# Altium schematic sheet Mesure.SchDoc
size A4
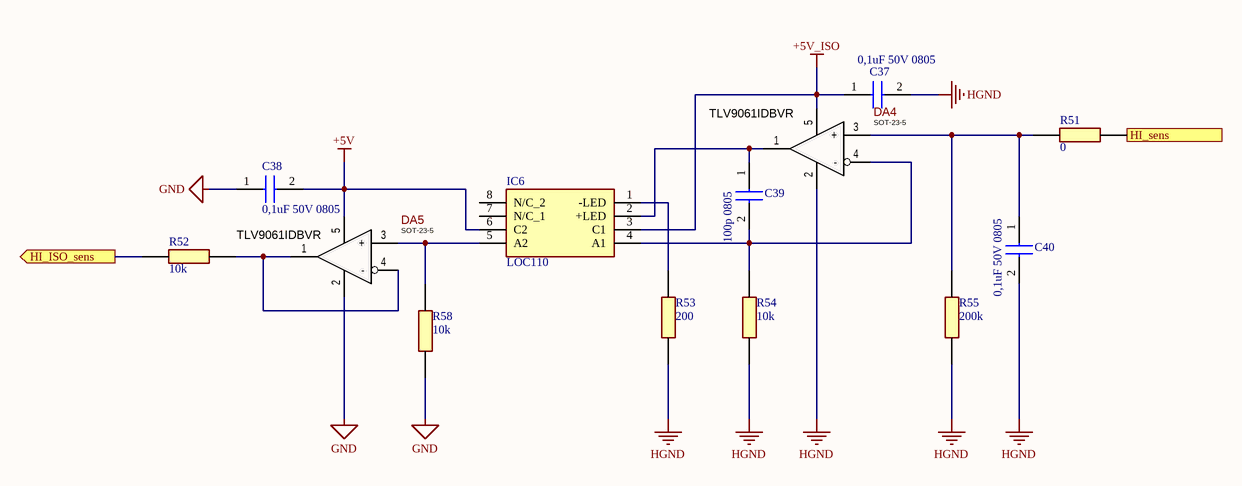
[diagram p0: Mesure.SchDoc]

## Parts
C37  0,1uF 50V 0805  [CAPC2012X90N]
C38  0,1uF 50V 0805  [CAPC2012X90N]
C39  100p 0805  [CAPC2012X90N]
C40  0,1uF 50V 0805  [CAPC2012X90N]
DA4  TLV9061IDBVR  [SOT-23-5]
DA5  TLV9061IDBVR  [SOT-23-5]
IC6  LOC110  [DIP762W53P254L965H335Q8N]
R51  0  [RESC2013X65N]
R52  10k  [RESC2013X65N]
R53  200  [RESC2013X65N]
R54  10k  [RESC2013X65N]
R55  200k  [RESC2013X65N]
R58  10k  [RESC2013X65N]

## Ports
HI_ISO_sens (out), HI_sens

## Nets
+5V: C38.2 DA5.5(V+) IC6.6(C2)
+5V_ISO: C37.1 DA4.5(V+) IC6.3(C1)
GND: C38.1 DA5.2(V-) R58.1
HGND: C37.2 C40.2 DA4.2(V-) R53.1 R54.1 R55.1
HI_ISO_sens: R52.2 ; port HI_ISO_sens
HI_sens: R51.1 ; port HI_sens
NetC39_1: C39.1 DA4.1(OUT) IC6.2(+LED)
NetC39_2: C39.2 DA4.4(-) IC6.4(A1) R54.2
NetC40_1: C40.1 DA4.3(+) R51.2 R55.2
NetDA5_1: DA5.1(OUT) DA5.4(-) R52.1
NetDA5_3: DA5.3(+) IC6.5(A2) R58.2
NetIC6_1: IC6.1(-LED) R53.2

Not connected (* = marked no-connect by the designer): IC6 7(N/C_1) 8(N/C_2)

## Library data of the parts
C37-C40 = MCMT21N470F250CT: Capacitor; Height: 0.9mm
DA4 DA5 = TLV9061IDBVR: 10MHz, 0.5pA Bias, Rail-to-Rail Input/Output, 1.8V CMOS Operational Amplifiers, 1 Channels, SOT-23-5; Manufacturer: Texas Instruments; Ajax_1C_ID: 24284; Ajax_1C_PN: TLV9061IDBVR TI 1.8V-5.5V Operational Amplifier IC SOT23-5; Ajax_1С_Status: Mass Production; Standard Lead Time: 16 Weeks; Replacement: NONE; Package: SOT-23-5; Part Number: TLV9061IDBVR; Part Type: Amplifier / OpAmp; Component Type: SMD; Temperature Range: -40°C ~ 125°C; ComponentLink1URL: https://www.ti.com/lit/ds/symlink/tlv9061.pdf; Supplier 1: Digi-Key; Supplier Part Number 1: 296-52284-2-ND; Price: 0,72409091; ComponentLink1Description: Datasheet
IC6 = LOC110: Integrated Circuit; Manufacturer_Name: LITTELFUSE; Datasheet Link: http://www.ixysic.com/home/pdfs.nsf/0/2E7C7ED81A9497A385256A2C0068BE89/$file/LOC110.pdf; Height: 3.353mm; Manufacturer_Part_Number: LOC110; Mouser Part Number: 849-LOC110; Mouser Price/Stock: https://www.mouser.co.uk/ProductDetail/IXYS-Integrated-Circuits/LOC110?qs=lQlU%252BwB40guWe%2FeQ%2FzktPA%3D%3D; Arrow Part Number: LOC110; Arrow Price/Stock: https://www.arrow.com/en/products/loc110/ixys
R51-R55 R58 = ERJP06J822V: Resistor; Height: 0.7mm